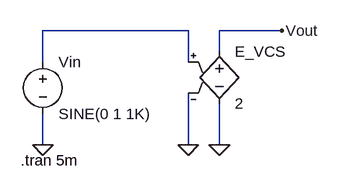
[diagram p0: schematic 02_dependentSource.asc]
02_dependentSource.asc, the LTspice schematic file:
Version 4
SHEET 1 880 680
WIRE 320 64 96 64
WIRE 464 64 368 64
WIRE 368 96 368 64
WIRE 96 112 96 64
WIRE 320 112 320 64
WIRE 96 240 96 192
WIRE 320 240 320 160
WIRE 368 240 368 176
FLAG 96 240 0
FLAG 320 240 0
FLAG 368 240 0
FLAG 464 64 Vout
SYMBOL voltage 96 96 R0
WINDOW 123 0 0 Left 0
WINDOW 39 0 0 Left 0
SYMATTR InstName Vin
SYMATTR Value SINE(0 1 1K)
SYMBOL e 368 80 R0
SYMATTR InstName E_VCS
SYMATTR Value 2
TEXT 62 264 Left 2 !.tran 5m

The netlist it stands for:
* 02_dependentSource.asc
Vin N001 0 SINE(0 1 1K)
E_VCS Vout 0 N001 0 2
.tran 5m
.backanno
.end